# Altium schematic sheet Power.SchDoc
size A4; CompanyName: TechOcean Sp. z o. o.; Address1: 02-639 Warszawa; Address2: Domaniewska 37A/119; Revision: 1.0; SheetNumber: 1; SheetTotal: 5
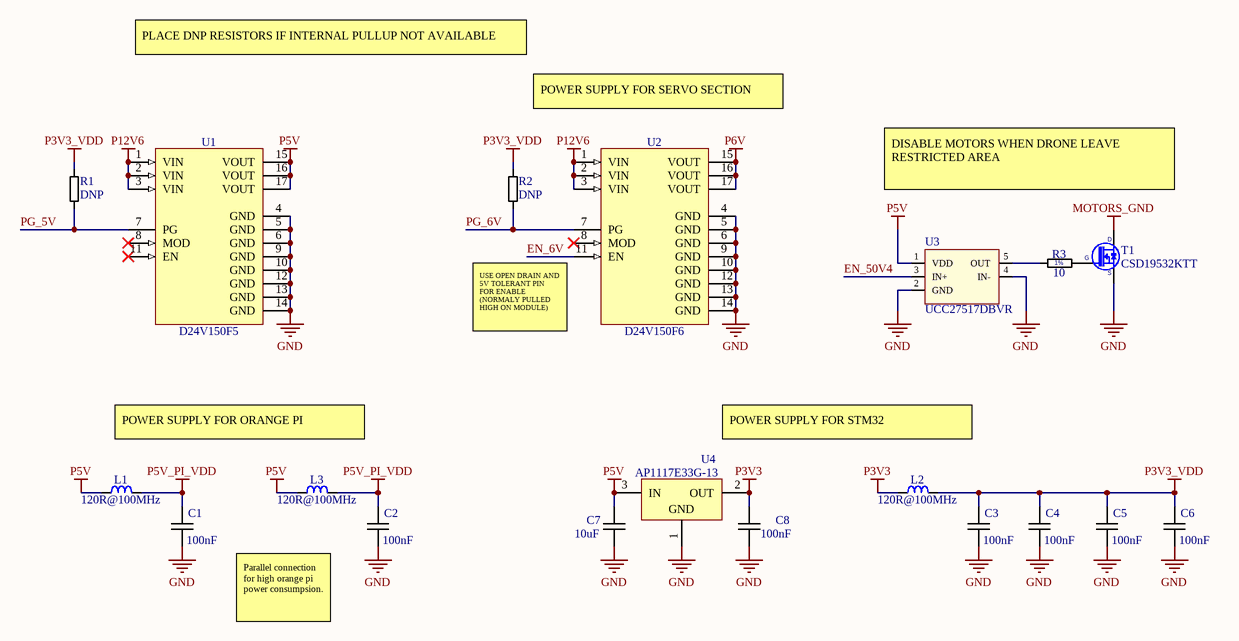
[diagram p0: Power.SchDoc]

## Parts
C1  100nF  [CAPC0603X90N]
C2  100nF  [CAPC0603X90N]
C3  100nF  [CAPC0603X90N]
C4  100nF  [CAPC0603X90N]
C5  100nF  [CAPC0603X90N]
C6  100nF  [CAPC0603X90N]
C7  10uF  [CAPC0603X90N]
C8  100nF  [CAPC0603X90N]
L1  120R@100MHz  [INDC0603X90N]
L2  120R@100MHz  [INDC0603X90N]
L3  120R@100MHz  [INDC0603X90N]
R1  DNP  [RESC0603X60N]
R2  DNP  [RESC0603X60N]
R3  10  [RESC0603X60N]
T1  CSD19532KTT  [TO263-2]
U1  D24V150F5  [D24V150Fx]
U2  D24V150F6  [D24V150Fx]
U3  UCC27517DBVR  [SOT23-5]
U4  AP1117E33G-13  [SOT223]

## Nets
GND: C1.1 C2.1 C3.1 C4.1 C5.1 C6.1 C7.1 C8.1 T1.2(S) U1.4(GND) U1.5(GND) U1.6(GND) U1.9(GND) U1.10(GND) U1.12(GND) U1.13(GND) U1.14(GND) U2.4(GND) U2.5(GND) U2.6(GND) U2.9(GND) U2.10(GND) U2.12(GND) U2.13(GND) U2.14(GND) U3.2(GND) U3.4(IN-) U4.1(GND)
MOTORS_GND: T1.3(D)
P3V3: C8.2 L2.1 U4.2(OUT)
P3V3_VDD: C3.2 C4.2 C5.2 C6.2 L2.2 R1.2 R2.2
P5V: C7.2 L1.1 L3.1 U1.15(VOUT) U1.16(VOUT) U1.17(VOUT) U3.1(VDD) U4.3(IN)
P5V_PI_VDD: C1.2 C2.2 L1.2 L3.2
P6V: U2.15(VOUT) U2.16(VOUT) U2.17(VOUT)
P12V6: U1.1(VIN) U1.2(VIN) U1.3(VIN) U2.1(VIN) U2.2(VIN) U2.3(VIN)
EN_6V: U2.11(EN)
EN_50V4: U3.3(IN+)
PG_5V: R1.1 U1.7(PG)
PG_6V: R2.1 U2.7(PG)
NetR3_1: R3.1 U3.5(OUT)
NetR3_2: R3.2 T1.1(G)

Not connected (* = marked no-connect by the designer): U1 8(MOD)* 11(EN)*; U2 8(MOD)*

## Notes on the sheet
- PLACE DNP RESISTORS IF INTERNAL PULLUP NOT AVAILABLE
- POWER SUPPLY FOR SERVO SECTION
- DISABLE MOTORS WHEN DRONE LEAVE RESTRICTED AREA
- (near U2) USE OPEN DRAIN AND 5V TOLERANT PIN FOR ENABLE (NORMALY PULLED HIGH ON MODULE)
- POWER SUPPLY FOR ORANGE PI
- POWER SUPPLY FOR STM32
- Parallel connection for high orange pi power consumpsion.
- Project:
- Variant:
- File:
- Sheet:
- Revision:
- Total Sheet:
- Politechnika Warszawska
- Wydział Elektryczny
- Pl. Politechniki 1
- Author:
- Piotr Czapnik
- Modified:
- 00-661 Warszawa

## Library data of the parts
C1-C6 C8 = CC0603_100NF_16V_10%_X7R: Non-polarised capacitor; Manufacturer: GENERIC; Manufacturer 1 Example: Vishay; Manufacturer 1 Part Number: VJ0603Y104KXJCW1BC; Manufacturer 1 Component Height: 0.8mm; PressFit: No; Dielectric: X7R; Tolerance: 10%; Voltage: 16V; DesignItemId: CC0603_100NF_16V_10%_X7R; Author: KB; Case: 0603 (1608 metric); Component Kind: Standard; HelpURL: https://www.vishay.com/docs/28548/vjw1bcbascomseries.pdf; Manufacturer Part Number: CC0603_100NF_16V_10%_X7R; Mounted: Yes; Part Description: Non-polarised capacitor; Pin Count: 2; Sense: No; SMD: Yes; Socket: No; Status: Recommended; Value: 100nF; Supplier 1: Farnell; Supplier 2: TME; Supplier 3: Mouser; Create Date: 01.04.2019; LatestRevisionDate: 01.04.2019; Supplier Part Number 1: 2896425; Supplier Part Number 2: VJ0603Y104KXJCW1BC; Supplier Part Number 3: 710-885012206046
C7 = CC0603_10UF_16V_20%_X5R: Non-polarised capacitor; Manufacturer: GENERIC; Manufacturer 1 Example: Samsung; Manufacturer 1 Part Number: CL10A106MO8NQNC; Manufacturer 1 Component Height: 0.8mm; PressFit: No; Dielectric: X5R; Tolerance: 20%; Voltage: 16V; DesignItemId: CC0603_10UF_16V_20%_X5R; Author: KB; Case: 0603 (1608 metric); Component Kind: Standard; HelpURL: https://www.vishay.com/docs/28548/vjw1bcbascomseries.pdf; Manufacturer Part Number: CC0603_10UF_16V_20%_X5R; Mounted: Yes; Part Description: Non-polarised capacitor; Pin Count: 2; Sense: No; SMD: Yes; Socket: No; Status: Recommended; Value: 10uF; Supplier 1: Farnell; Supplier 2: TME; Supplier 3: Mouser; Create Date: 01.04.2019; LatestRevisionDate: 01.04.2019; Supplier Part Number 1: 2611923; Supplier Part Number 2: CL10A106MO8NQNC; Supplier Part Number 3: 81-GRM188R61C106KALD
L1-L3 = FB0603_120R@100MHZ_2A: Ferrite Bead; Manufacturer: GENERIC; Manufacturer 1 Example: Murata; Manufacturer 1 Part Number: BLM18PG121SN1D; Manufacturer 1 Component Height: 0.8mm; PressFit: No; Tolerance: 25%; DesignItemId: FB0603_120R@100MHZ_2A; Author: KB; Case: 0603 (1608 metric); Component Kind: Standard; HelpURL: https://www.tme.eu/Document/19a35c43258593752611d1c31a7dbf1a/MURATA-BLM18P.pdf; Manufacturer Part Number: FB0603_120R@100MHZ_2A; Mounted: Yes; Part Description: Ferrite Bead; Pin Count: 2; Sense: No; SMD: Yes; Socket: No; Status: Recommended; Value: 120R@100MHz; Supplier 1: Farnell; Supplier 2: TME; Supplier 3: Mouser; Create Date: 01.04.2019; LatestRevisionDate: 01.04.2019; Supplier Part Number 1: 1515738; Supplier Part Number 2: BLM18PG121SN1D; Supplier Part Number 3: 81-BLM18PG121SN1D
R1 R2 = R0603_DNP: General Purpose Thick Film Chip Resistor; Manufacturer: GENERIC; Manufacturer 1 Component Height: 0.5mm; Mounted: No; Current Max: 2; PressFit: No; Voltage: 75V; DesignItemId: R0603_DNP; Author: KB; Case: 0603 (1608 metric); Component Kind: Standard; Component Type: Standard; HelpURL: https://www.vishay.com/docs/20035/dcrcwe3.pdf; Manufacturer Part Number: DNP; Part Description: General Purpose Thick Film Chip Resistor; Pin Count: 2; Power: -; Sense: No; SMD: Yes; Socket: No; Status: Recommended; TC: -; Value: DNP; Create Date: 03.07.2019; LatestRevisionDate: 03.07.2019
R3 = R0603_10R0_0.1W_100PPM: General Purpose Thick Film Chip Resistor; Manufacturer: GENERIC; Manufacturer Part Number: R0603_10R0_0.0625W 0.1W 0.125W 0.25W 0.5W 1W 0.75W 1W_100PPM; Manufacturer 1 Example: Vishay; Manufacturer 1 Part Number: CRCW060310R0FKEDC; Manufacturer 1 Component Height: 0.5mm; Power: 100mW; Current Max: 0; PressFit: No; TC: ?100 ppm/?C; Tolerance: 1%; Voltage: 75V; DesignItemId: R0603_10R0_0.1W_100PPM; Author: KB; Case: 0603 (1608 metric); Component Kind: Standard; Component Type: Standard; HelpURL: https://www.vishay.com/docs/20035/dcrcwe3.pdf; Mounted: Yes; Part Description: General Purpose Thick Film Chip Resistor; Pin Count: 2; Sense: No; SMD: Yes; Socket: No; Status: Recommended; Value: 10; Supplier 1: Farnell; Supplier 2: TME; Supplier 3: Mouser; Create Date: 03.07.2019; LatestRevisionDate: 03.07.2019
T1 = CSD19532KTT: N-MOS 100V 98A 4.6mOhm; Manufacturer 1 Example: Texas Instruments; Manufacturer 1 Component Height: 4.6mm; PressFit: No; DesignItemId: CSD19532KTT; Author: PC; Device: CSD19532KTT; Component Kind: Standard; HelpURL: http://www.ti.com/lit/ds/symlink/csd19532ktt.pdf; Manufacturer 1 Part Number: CSD19532KTT; Mounted: Yes; Part Description: N-MOS 100V 98A 4.6mOhm; Pin Count: 2; Sense: No; SMD: Yes; Socket: No; Supplier 1: TME; Supplier 2: Mouser; Supplier 3: Digi-Key; Create Date: 03.03.2019; LatestRevisionDate: 03.03.2019; Supplier Part Number 1: CSD19532KTTT; Supplier Part Number 3: 296-CSD19532KTTCT-ND
U1 = D24V150F5: DC-DC Step-Down, IN: 6...40V, OUT: 5V; Manufacturer 1 Example: POLOLU; Manufacturer 1 Component Height: 11.37mm; PressFit: No; DesignItemId: D24V150F5; Author: PC; Device: D24V150F5; Component Kind: Standard; HelpURL: https://www.pololu.com/product/2881; Manufacturer 1 Part Number: D24V150F5; Mounted: Yes; Part Description: DC-DC Step-Down, IN: 6...40V, OUT: 5V; Pin Count: 17; Sense: No; SMD: No; Socket: No; Supplier 1: TME; Supplier 2: Botland; Supplier 3: Kamami; Create Date: 10.03.2020; LatestRevisionDate: 10.03.2020; Supplier Part Number 1: POLOLU-2881; Supplier Part Number 3: 563205
U2 = D24V150F6: DC-DC Step-Down, IN: 7.2...40V, OUT: 6V; Manufacturer 1 Example: POLOLU; Manufacturer 1 Component Height: 11.37mm; PressFit: No; DesignItemId: D24V150F6; Author: PC; Device: D24V150F6; Component Kind: Standard; HelpURL: https://www.pololu.com/product/2882; Manufacturer 1 Part Number: D24V150F6; Mounted: Yes; Part Description: DC-DC Step-Down, IN: 7.2...40V, OUT: 6V; Pin Count: 17; Sense: No; SMD: No; Socket: No; Supplier 1: TME; Supplier 2: Botland; Supplier 3: Kamami; Create Date: 10.03.2020; LatestRevisionDate: 10.03.2020; Supplier Part Number 1: POLOLU-2882; Supplier Part Number 3: 563591
U3 = UCC27517DBVR: FET Single Gate Driver IC; Manufacturer 1 Example: Texas Instruments; Manufacturer 1 Component Height: 1.45mm; PressFit: No; ComponentLink1Description: datasheet; ComponentLink1URL: x; Supplier 1: Mouser; Manufacturer 1: *; Supplier Part Number 1: 595-UCC27517DBVR; Manufacturer Part Number 1: *; DesignItemId: UCC27517DBVR; Author: BS; Device: UCC27517DBVR; Component Kind: Standard; HelpURL: http://www.ti.com/lit/ds/symlink/ucc27517.pdf; Manufacturer 1 Part Number: UCC27517DBVR; Mounted: Yes; Part Description: FET Single Gate Driver IC; Pin Count: 5; Sense: No; SMD: Yes; Socket: No; Supplier 2: Farnell; Create Date: 03.12.2019; LatestRevisionDate: 03.12.2019; Supplier Part Number 2: 3005801
U4 = AP1117E33G-13: 1A Low dropout positive P3V3 regulator; Manufacturer 1 Example: Diodes Incorporated; Manufacturer 1 Component Height: 1.75mm; PressFit: No; DesignItemId: AP1117E33G-13; Author: JK; Device: AP1117E33G-13; Component Kind: Standard; HelpURL: https://www.tme.eu/Document/601a4b72f2e6cfc100b2c2e81e705fa8/ap1117.pdf; Manufacturer 1 Part Number: AP1117E33G-13; Mounted: Yes; Part Description: 1A Low dropout positive P3V3 regulator; Pin Count: 3; Sense: No; SMD: Yes; Socket: No; Supplier 1: TME; Supplier 2: Farnell; Supplier 3: Mouser; Create Date: 05.09.2019; LatestRevisionDate: 05.09.2019; Supplier Part Number 1: AP1117E33G-13; Supplier Part Number 2: 1825291; Supplier Part Number 3: 621-AP1117E33G-13